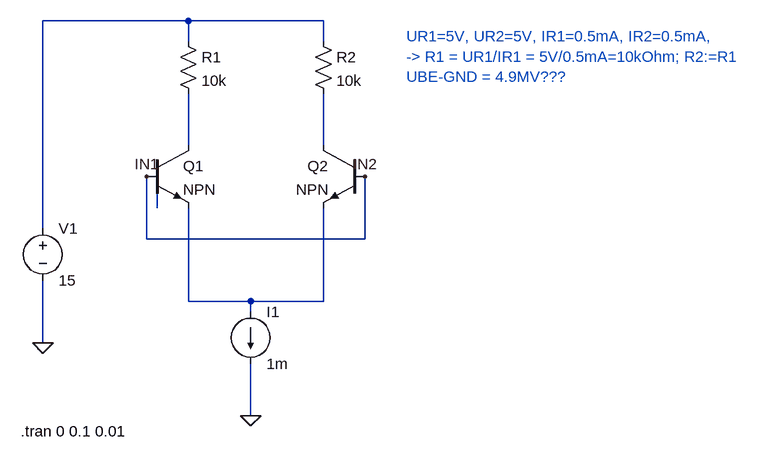
[diagram p0: schematic LaboruebungDiffVerstaerker.asc]
LaboruebungDiffVerstaerker.asc, the LTspice schematic file:
Version 4
SHEET 1 1492 680
WIRE 144 -256 -80 -256
WIRE 352 -256 144 -256
WIRE 144 -224 144 -256
WIRE 352 -224 352 -256
WIRE 144 -64 144 -144
WIRE 352 -64 352 -144
WIRE 96 32 96 -16
WIRE -80 64 -80 -256
WIRE 80 80 80 -16
WIRE 416 80 416 -16
WIRE 416 80 80 80
WIRE 144 176 144 32
WIRE 240 176 144 176
WIRE 352 176 352 32
WIRE 352 176 240 176
WIRE 240 192 240 176
WIRE -80 240 -80 144
WIRE 240 352 240 272
FLAG 240 352 0
FLAG -80 240 0
FLAG 80 -16 IN1
FLAG 416 -16 IN2
SYMBOL current 240 192 R0
WINDOW 123 0 0 Left 0
WINDOW 39 0 0 Left 0
SYMATTR InstName I1
SYMATTR Value 1m
SYMBOL voltage -80 48 R0
WINDOW 123 0 0 Left 0
WINDOW 39 0 0 Left 0
SYMATTR InstName V1
SYMATTR Value 15
SYMBOL npn 80 -64 R0
SYMATTR InstName Q1
SYMBOL npn 416 -64 M0
SYMATTR InstName Q2
SYMBOL res 128 -240 R0
SYMATTR InstName R1
SYMATTR Value 10k
SYMBOL res 336 -240 R0
SYMATTR InstName R2
SYMATTR Value 10k
TEXT -114 376 Left 2 !.tran 0 0.1 0.01
TEXT 480 -232 Left 2 ;UR1=5V, UR2=5V, IR1=0.5mA, IR2=0.5mA, \n-> R1 = UR1/IR1 = 5V/0.5mA=10kOhm; R2:=R1\nUBE-GND = 4.9MV???

The netlist it stands for:
* LaboruebungDiffVerstaerker.asc
I1 N005 0 1m
V1 N001 0 15
Q1 N002 IN2 N005 0 NPN
Q2 N003 IN2 N005 0 NPN
R1 N001 N002 10k
R2 N001 N003 10k
.model NPN NPN
.model PNP PNP
.lib standard.bjt
.tran 0 0.1 0.01
* UR1=5V, UR2=5V, IR1=0.5mA, IR2=0.5mA,
* -> R1 = UR1/IR1 = 5V/0.5mA=10kOhm; R2:=R1
* UBE-GND = 4.9MV???
.backanno
.end